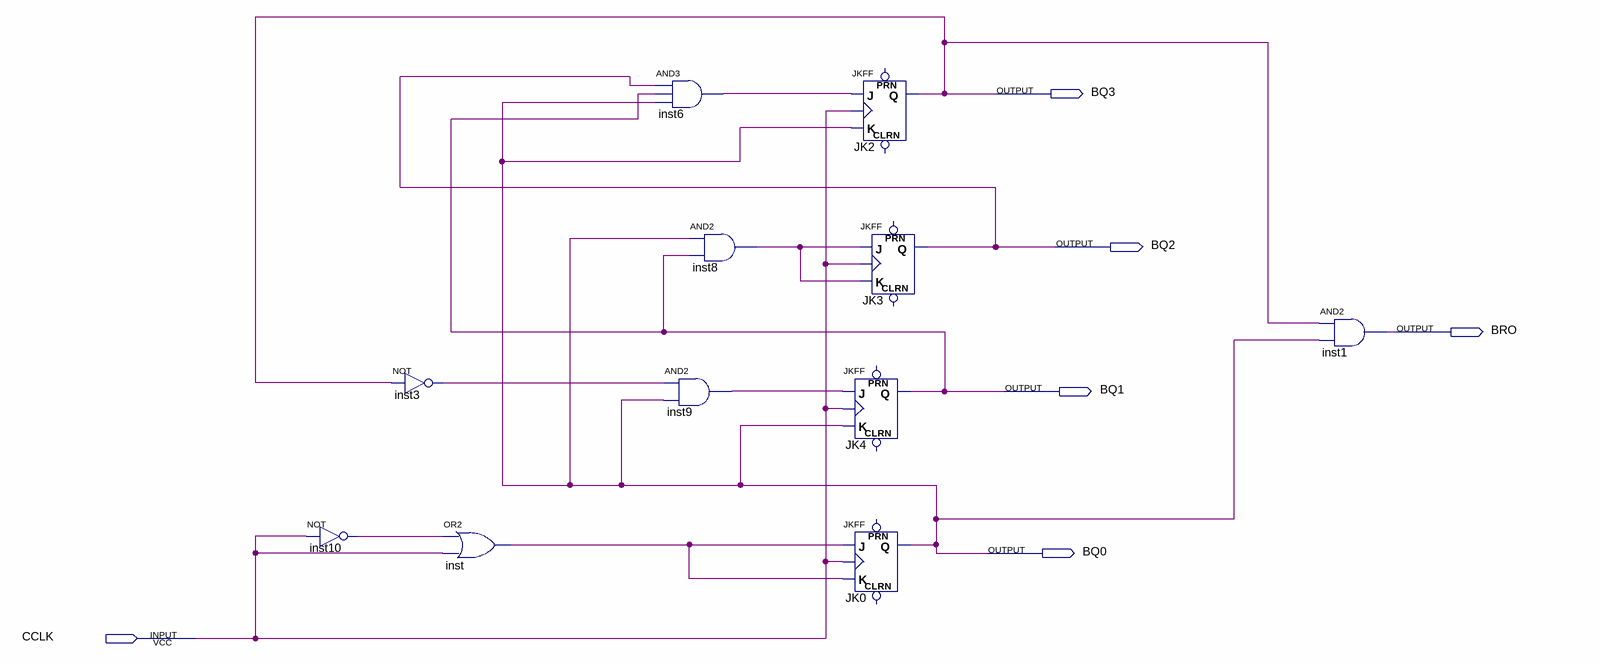
[diagram p0: schematic sheet]
// Quartus schematic BCDcounterwithcounter.bdf as structural Verilog: 11 symbols, 6 pins
module BCDcounterwithcounter (
  input  CCLK,
  output BQ3,
  output BQ2,
  output BRO,
  output BQ1,
  output BQ0
);

  wire inst3_out, inst6_out, inst8_out, inst9_out, inst10_out, inst_out;

  not inst10 (inst10_out, CCLK);
  not inst3 (inst3_out, BQ3);
  or inst (inst_out, inst10_out, CCLK);
  and inst6 (inst6_out, BQ2, BQ1, BQ0);
  and inst8 (inst8_out, BQ0, BQ1);
  and inst9 (inst9_out, inst3_out, BQ0);
  JKFF JK2 (.K(BQ0), .J(inst6_out), .CLK(CCLK), .Q(BQ3));  // open: PRN, CLRN
  JKFF JK4 (.K(BQ0), .J(inst9_out), .CLK(CCLK), .Q(BQ1));  // open: PRN, CLRN
  JKFF JK0 (.K(inst_out), .J(inst_out), .CLK(CCLK), .Q(BQ0));  // open: PRN, CLRN
  JKFF JK3 (.K(inst8_out), .J(inst8_out), .CLK(CCLK), .Q(BQ2));  // open: PRN, CLRN
  and inst1 (BRO, BQ3, BQ0);
endmodule
